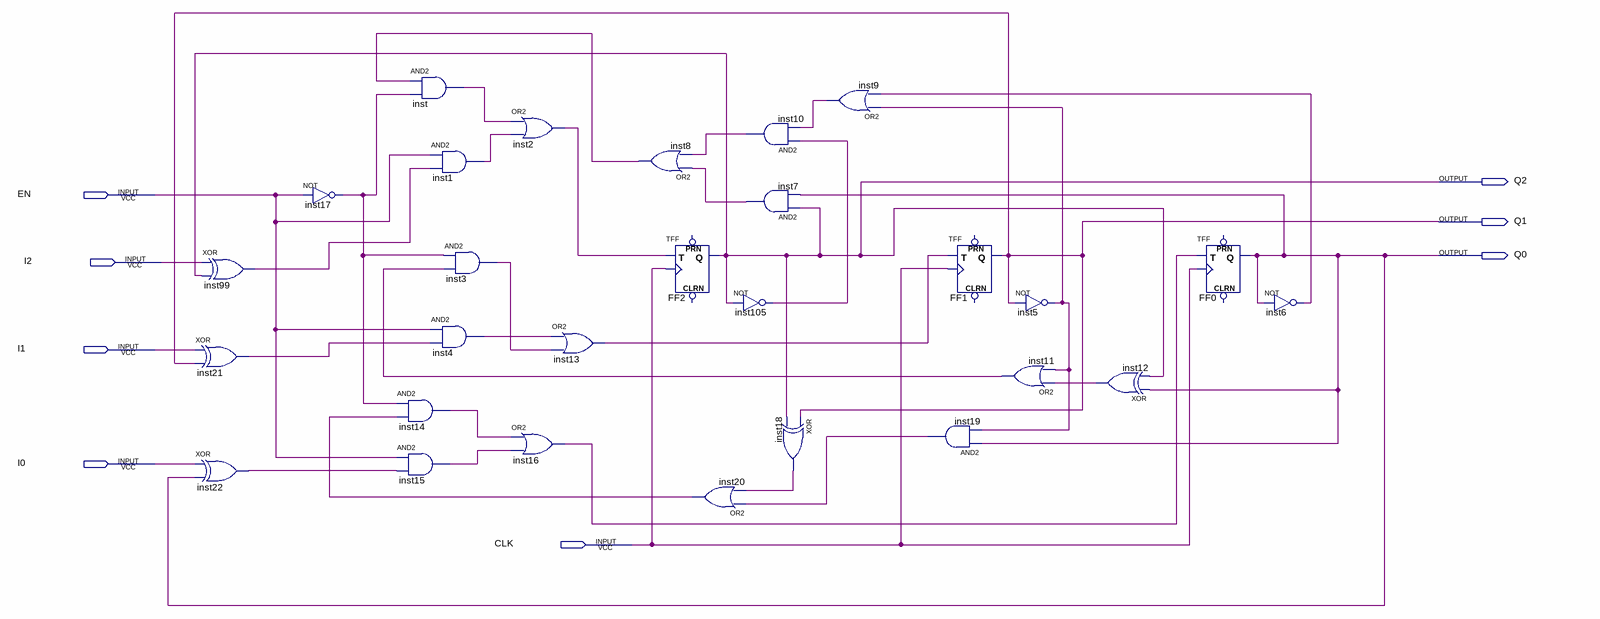
[diagram p0: schematic sheet]
// Quartus schematic design.bdf as structural Verilog: 28 symbols, 8 pins
module \design  (
  input  EN,
  input  I2,
  input  I1,
  input  I0,
  input  CLK,
  output Q2,
  output Q1,
  output Q0
);

  wire inst1_out, inst2_out, inst3_out, inst4_out, inst5_out, inst6_out, inst7_out, inst8_out, inst9_out,
       inst10_out, inst11_out, inst12_out, inst13_out, inst14_out, inst15_out, inst16_out, inst17_out,
       inst18_out, inst19_out, inst20_out, inst21_out, inst22_out, inst99_out, inst105_out, inst_out;

  xor inst99 (inst99_out, I2, Q2);
  xor inst21 (inst21_out, I1, Q1);
  xor inst22 (inst22_out, I0, Q0);
  not inst17 (inst17_out, EN);
  and inst (inst_out, inst8_out, inst17_out);
  and inst1 (inst1_out, EN, inst99_out);
  and inst3 (inst3_out, inst17_out, inst11_out);
  and inst4 (inst4_out, EN, inst21_out);
  and inst14 (inst14_out, inst17_out, inst20_out);
  and inst15 (inst15_out, EN, inst22_out);
  or inst2 (inst2_out, inst_out, inst1_out);
  or inst13 (inst13_out, inst4_out, inst3_out);
  or inst16 (inst16_out, inst14_out, inst15_out);
  or inst8 (inst8_out, inst7_out, inst10_out);
  TFF FF2 (.T(inst2_out), .CLK(CLK), .Q(Q2));  // open: PRN, CLRN
  or inst20 (inst20_out, inst19_out, inst18_out);
  and inst10 (inst10_out, inst105_out, inst9_out);
  and inst7 (inst7_out, Q2, Q0);
  not inst105 (inst105_out, Q2);
  xor inst18 (inst18_out, Q1, Q2);
  or inst9 (inst9_out, inst5_out, inst6_out);
  and inst19 (inst19_out, Q0, inst5_out);
  TFF FF1 (.T(inst13_out), .CLK(CLK), .Q(Q1));  // open: PRN, CLRN
  not inst5 (inst5_out, Q1);
  or inst11 (inst11_out, inst12_out, inst5_out);
  xor inst12 (inst12_out, Q0, Q2);
  TFF FF0 (.T(inst16_out), .CLK(CLK), .Q(Q0));  // open: PRN, CLRN
  not inst6 (inst6_out, Q0);
endmodule
